# EAGLE design ispshield (EAGLE 5.04)
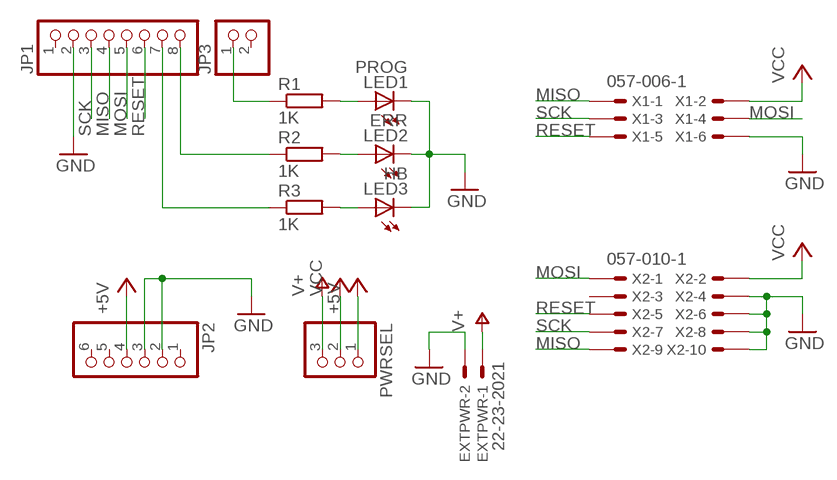
[diagram p0: schematic, sheet 1]

## Parts
EXTPWR  22-23-2021  [22-23-2021]
JP1  PINHD-1X8  [1X08]
JP2  PINHD-1X6  [1X06]
JP3  PINHD-1X2  [1X02]
LED1  PROG  LED3MM  [LED3MM]
LED2  ERR  LED3MM  [LED3MM]
LED3  HB  LED3MM  [LED3MM]
PWRSEL  PINHD-1X3  [1X03]
R1  1K  R-EU_0204/7  [0204/7]
R2  1K  R-EU_0204/7  [0204/7]
R3  1K  R-EU_0204/7  [0204/7]
X1  057-006-1  [057-006-1]
X2  057-010-1  [057-010-1]

## Nets
+5V: JP2.4 PWRSEL.1
ERR: JP1.8 R2.1
GND: EXTPWR.2 JP1.2 JP2.2 JP2.3 LED1.K(C) LED2.K(C) LED3.K(C) X1.6 X2.4 X2.6 X2.8 X2.10
HB: JP1.7 R3.1
MISO: JP1.4 X1.1 X2.9
MOSI: JP1.5 X1.4 X2.1
N$2: LED1.A R1.2
N$3: LED2.A R2.2
N$4: LED3.A R3.2
PMODE: JP3.1 R1.1
RESET: JP1.6 X1.5 X2.5
SCK: JP1.3 X1.3 X2.7
V+: EXTPWR.1 PWRSEL.3
VCC: PWRSEL.2 X1.2 X2.2
Unconnected: JP1.1 JP2.1 JP2.5 JP2.6 JP3.2 X2.3

## Library data of the parts
EXTPWR = con-molex:22-23-2021: .100" (2.54mm) Center Header - 2 Pin
JP1 = pinhead:PINHD-1X8: PIN HEADER
JP2 = pinhead:PINHD-1X6: PIN HEADER
JP3 = pinhead:PINHD-1X2: PIN HEADER
LED1-LED3 = led:LED: LED OSRAM: - CHIPLED LG R971, LG N971, LY N971, LG Q971, LY Q971, LO R971, LY R971 LH N974, LH R974 LS Q976, LO Q976, LY Q976 LO Q996 - Hyper CHIPLED LW Q18S LB Q993, LB Q99A, LB R99A - SideLED LS A670, LO A670, LY A670, LG A670, LP A670 LB A673, LV A673, LT A673, LW A673 LH A674 LY A675 LS A676, LA A676, LO A676, LY A676, LW A676 LS A679, LY A679, LG A679 - Hyper Micro SIDELED® LS Y876, LA Y876, LO Y876, LY Y876 LT Y87S - SmartLED LW L88C, LW L88S LB L89C, LB L89S, LG L890 LS L89K, LO L89K, LY L89K LS L896, LA L896, LO L896, LY L896 - TOPLED LS T670, LO T670, LY T670, LG T670, LP T670 LSG T670, LSP T670, LSY T670, LOP T670, LYG T670 LG T671, LOG T671, LSG T671 LB T673, LV T673, LT T673, LW T673 LH T674 LS T676, LA T676, LO T676, LY T676, LB T676, LH T676, LSB T676, LW T676 LB T67C, LV T67C, LT T67C, LS T67K, LO T67K, LY T67K, LW E67C LS E67B, LA E67B, LO E67B, LY E67B, LB E67C, LV E67C, LT E67C LW T67C LS T679, LY T679, LG T679 LS T770, LO T770, LY T770, LG T770, LP T770 LB T773, LV T773, LT T773, LW T773 LH T774 LS E675, LA E675, LY E675, LS T675 LS T776, LA T776, LO T776, LY T776, LB T776 LHGB T686 LT T68C, LB T68C - Hyper Mini TOPLED® LB M676 - Mini TOPLED Santana® LG M470 LS M47K, LO M47K, LY M47K Source: http://www.osram.convergy.de LUXEON: - LUMILED® LXK2-PW12-R00, LXK2-PW12-S00, LXK2-PW14-U00, LXK2-PW14-V00 LXK2-PM12-R00, LXK2-PM12-S00, LXK2-PM14-U00 LXK2-PE12-Q00, LXK2-PE12-R00, LXK2-PE12-S00, LXK2-PE14-T00, LXK2-PE14-U00 LXK2-PB12-K00, LXK2-PB12-L00, LXK2-PB12-M00, LXK2-PB14-N00, LXK2-PB14-P00, LXK2-PB14-Q00 LXK2-PR12-L00, LXK2-PR12-M00, LXK2-PR14-Q00, LXK2-PR14-R00 LXK2-PD12-Q00, LXK2-PD12-R00, LXK2-PD12-S00 LXK2-PH12-R00, LXK2-PH12-S00 LXK2-PL12-P00, LXK2-PL12-Q00, LXK2-PL12-R00 Source: www.luxeon.com KINGBRIGHT: KA-3528ASYC Source: www.kingbright.com
PWRSEL = pinhead:PINHD-1X3: PIN HEADER
R1-R3 = rcl:R-EU_: RESISTOR, European symbol
X1 = con-panduit:057-006-: CONNECTOR 6-pin series 057 contact pc board low profile headers
X2 = con-panduit:057-010-: CONNECTOR 10-pin series 057 contact pc board low profile headers

## Board
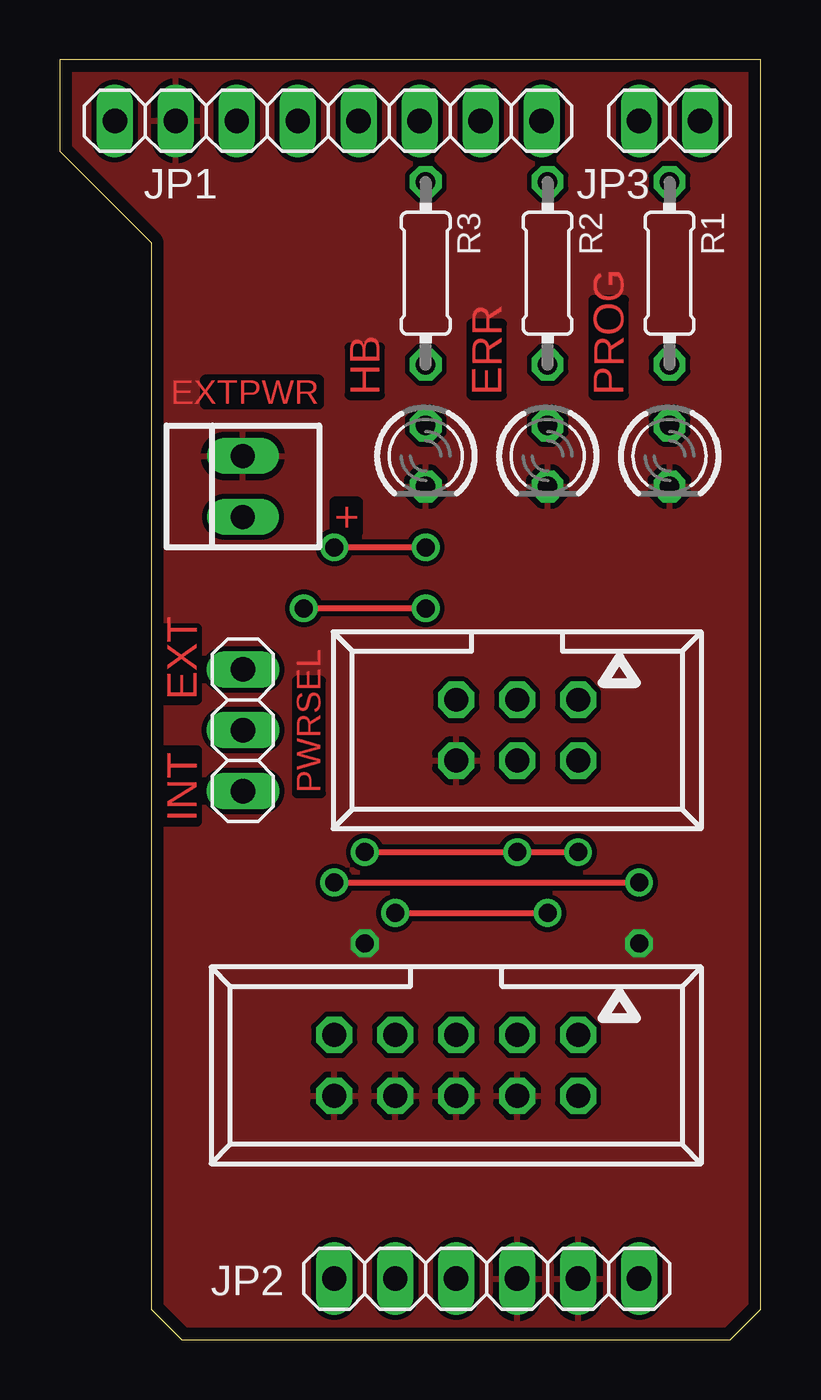
[diagram p1: board, top side]
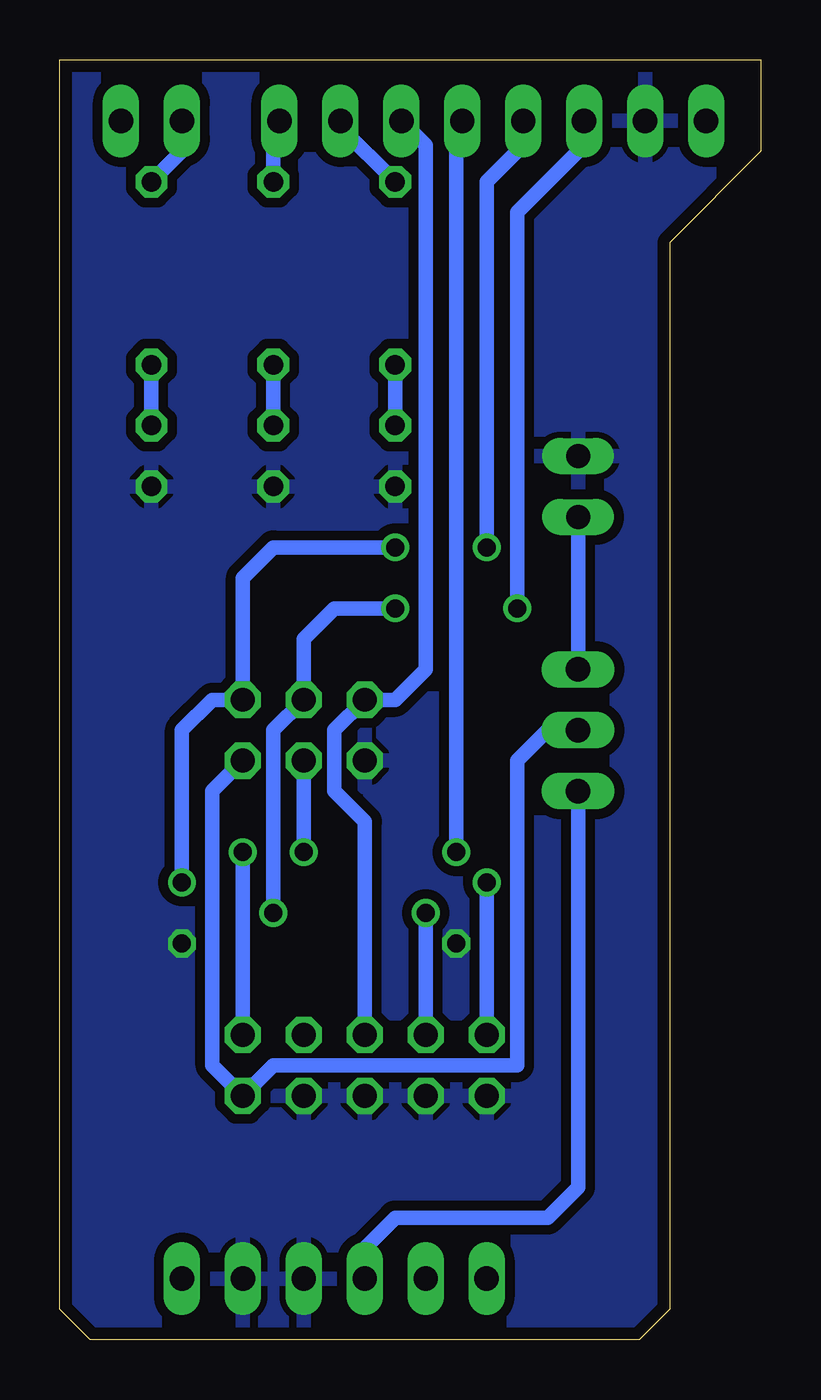
[diagram p2: board, bottom side, seen from below]

Size 29.21 x 53.34 mm. Coordinates in mm from the lower left corner, seen from the top.
Outline: 5.08,0 27.94,0 29.21,1.27 29.21,53.34 0,53.34 0,49.53 3.81,45.72 3.81,1.27 5.08,0
Copper layers (1*16): Top 0.035mm / dielectric 1.5mm / Bottom 0.035mm
Design rules "default *": minimum track width 10mil, minimum drill 24mil, track to track 8mil, track to pad 8mil, pad to pad 8mil, via to via 8mil, smd to smd 8mil, copper to edge 20mil, drill to drill 8mil, minimum pad ring 10mil, minimum via ring 8mil, stop-mask expansion 4mil, vias tented up to drill 0mil, thermal gap 10mil

### Footprints (pad centres in the part's own frame; a part is rotated, then mirrored left to right if it is on the bottom)
22-23-2021 = drill 1 long: 1 -1.27,0; 2 1.27,0
1X08 = drill 1.016 long: 1 -8.89,0; 2 -6.35,0; 3 -3.81,0; 4 -1.27,0; 5 1.27,0; 6 3.81,0; 7 6.35,0; 8 8.89,0
1X06 = drill 1.016 long: 1 -6.35,0; 2 -3.81,0; 3 -1.27,0; 4 1.27,0; 5 3.81,0; 6 6.35,0
1X02 = drill 1.016 long: 1 -1.27,0; 2 1.27,0
LED3MM = drill 0.813 octagon: A -1.27,0; K 1.27,0
1X03 = drill 1.016 long: 1 -2.54,0; 2 0,0; 3 2.54,0
0204/7 = drill 0.813 octagon: 1 -3.81,0; 2 3.81,0
057-006-1 = drill 1 octagon: 1 -2.54,-1.27; 2 -2.54,1.27; 3 0,-1.27; 4 0,1.27; 5 2.54,-1.27; 6 2.54,1.27
057-010-1 = drill 1 octagon: 1 -5.08,-1.27; 2 -5.08,1.27; 3 -2.54,-1.27; 4 -2.54,1.27; 5 0,-1.27; 6 0,1.27; 7 2.54,-1.27; 8 2.54,1.27; 9 5.08,-1.27; 10 5.08,1.27

### Placement (x,y rotation side)
EXTPWR  7.62,35.56 90 top
JP1  11.18,50.8 0 top
JP2  17.78,2.54 180 top
JP3  25.4,50.8 0 top
LED1  25.4,36.83 270 top
LED2  20.32,36.83 270 top
LED3  15.24,36.83 270 top
PWRSEL  7.62,25.4 90 top
R1  25.4,44.45 270 top
R2  20.32,44.45 270 top
R3  15.24,44.45 270 top
X1  19.05,25.4 180 top
X2  16.51,11.43 180 top

### Tracks (layer width: path | path; a pad name or v marks a point on that pad's centre or on a via)
+5V
  Bottom 0.254: 16.51,3.81 JP2.4
  Bottom 0.61: PWRSEL.1 7.62,6.35 8.89,5.08 15.24,5.08 16.51,3.81
ERR
  Bottom 0.254: 20.32,49.53 20.07,49.78
  Bottom 0.61: 20.07,49.78 JP1.8 | R2.1 20.32,49.53
GND  (via drill 0.75)
  other vias: 12.7,16.51 24.13,16.51
  pour Bottom (isolate 0.406): 0,53.34 30.48,53.34 30.48,0 0,0
  pour Top: 0,53.34 29.21,53.34 29.21,1.27 27.94,0 5.08,0 3.81,1.27 3.81,45.72 0,49.53
HB
  Bottom 0.254: 17.53,50.55 JP1.7
  Bottom 0.61: R3.1 17.53,50.55
MISO  (via drill 0.75)
  Top 0.254: v11.43,19.05 v24.13,19.05 | v15.24,33.02 v11.43,33.02
  Bottom 0.254: 9.91,49.78 JP1.4
  Bottom 0.61: 9.91,49.78 11.43,48.26 v11.43,33.02 | v15.24,33.02 20.32,33.02 21.59,31.75 X1.1 22.86,26.67 24.13,25.4 v24.13,19.05 | X2.9 v11.43,19.05
MOSI  (via drill 0.75)
  Top 0.254: v12.7,20.32 v19.05,20.32 v21.59,20.32
  Bottom 0.254: 12.7,49.53 12.45,49.78
  Bottom 0.61: 12.45,49.78 JP1.5 | v12.7,20.32 12.7,49.53 | v21.59,20.32 X2.1 | v19.05,20.32 X1.4
N$2
  Bottom 0.61: LED1.A R1.2
N$3
  Bottom 0.61: LED2.A R2.2
N$4
  Bottom 0.61: LED3.A R3.2
PMODE
  Bottom 0.61: JP3.1 24.13,49.53 R1.1
RESET
  Bottom 0.61: X2.5 16.51,21.59 17.78,22.86 17.78,25.4 X1.5 15.24,26.67 13.97,27.94 13.97,49.78 JP1.6
SCK  (via drill 0.75)
  Top 0.254: v13.97,17.78 v20.32,17.78 | v15.24,30.48 v10.16,30.48
  Bottom 0.61: JP1.3 7.37,49.78 10.16,46.99 v10.16,30.48 | v15.24,30.48 17.78,30.48 19.05,29.21 X1.3 20.32,25.4 v20.32,17.78 | X2.7 v13.97,17.78
V+
  Bottom 0.61: PWRSEL.3 EXTPWR.1
VCC
  Bottom 0.254: 8.89,25.4 PWRSEL.2
  Bottom 0.61: 8.89,25.4 10.16,24.13 10.16,11.43 20.32,11.43 X2.2 22.86,11.43 22.86,22.86 X1.2

### Text on the board
Top: + | EXT | INT